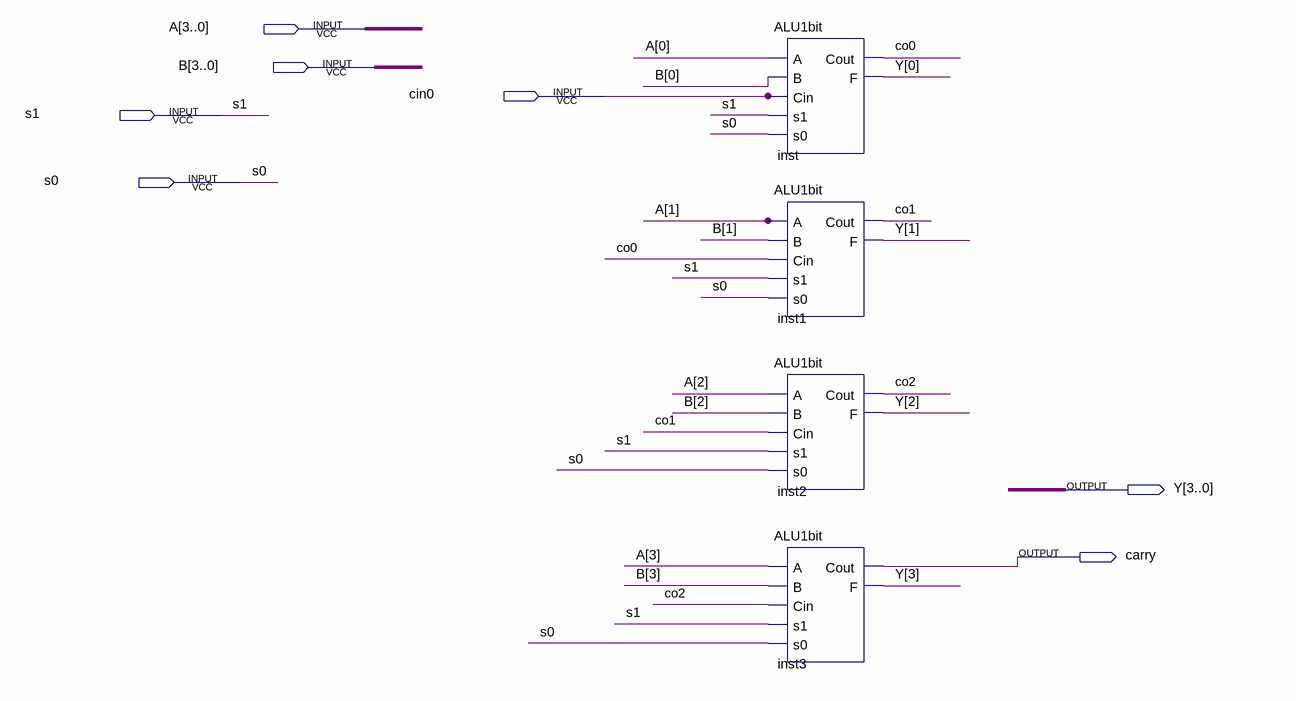
[diagram p0: schematic sheet]
// Quartus schematic demo1.bdf as structural Verilog: 4 symbols, 7 pins
module demo1 (
  input  [3:0] A,
  input  [3:0] B,
  input  cin0,
  input  s1,
  input  s0,
  output [3:0] Y,
  output carry
);

  wire co0, co1, co2;

  ALU1bit inst (.A(A[0]), .B(B[0]), .Cin(cin0), .s1(s1), .s0(s0), .Cout(co0), .F(Y[0]));
  ALU1bit inst1 (.A(A[1]), .B(B[1]), .Cin(co0), .s1(s1), .s0(s0), .Cout(co1), .F(Y[1]));
  ALU1bit inst2 (.A(A[2]), .B(B[2]), .Cin(co1), .s1(s1), .s0(s0), .Cout(co2), .F(Y[2]));
  ALU1bit inst3 (.A(A[3]), .B(B[3]), .Cin(co2), .s1(s1), .s0(s0), .Cout(carry), .F(Y[3]));
endmodule
